# EAGLE design MV16_v1.4 (EAGLE 9.6.2)
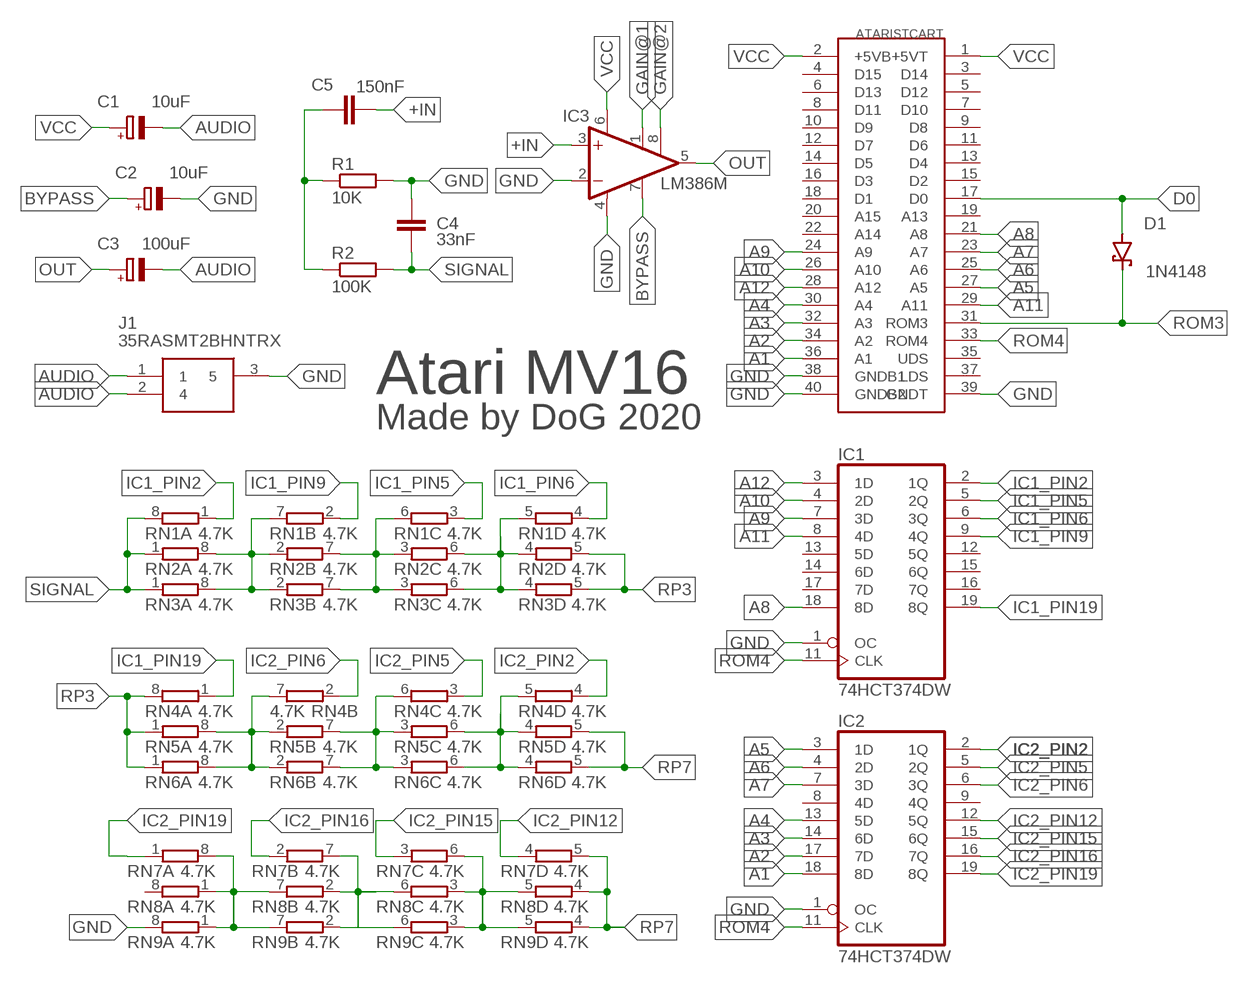
[diagram p0: schematic, sheet 1]

## Parts
C1  10uF  CPOL-EUUD-5X5,8  [UD-5X5,8_NICHICON]
C2  10uF  CPOL-EUUD-5X5,8  [UD-5X5,8_NICHICON]
C3  100uF  CPOL-EUUD-6,3X7,7  [UD-6,3X7,7_NICHICON]
C4  33nF  C-EU  [E/7260-38_NP]
C5  150nF  C-EU  [E/7260-38_NP]
D1  1N4148  BAT60J  [SOD323_ST]
IC1  74HCT374DW  [SO20W]
IC2  74HCT374DW  [SO20W]
IC3  LM386M  LM386M-1  [SO08]
J1  35RASMT2BHNTRX  [35RASMT2BHNTRX_1]
P1  ATARI_ST_CART_FIXED  [ATARI_ST_CART]
R1  10K  R-EU_R0805  [R0805]
R2  100K  R-EU_R0805  [R0805]
RN1  4.7K  4R-NEXBV8V  [EXBV8V]
RN2  4.7K  4R-NEXBV8V  [EXBV8V]
RN3  4.7K  4R-NEXBV8V  [EXBV8V]
RN4  4.7K  4R-NEXBV8V  [EXBV8V]
RN5  4.7K  4R-NEXBV8V  [EXBV8V]
RN6  4.7K  4R-NEXBV8V  [EXBV8V]
RN7  4.7K  4R-NEXBV8V  [EXBV8V]
RN8  4.7K  4R-NEXBV8V  [EXBV8V]
RN9  4.7K  4R-NEXBV8V  [EXBV8V]

## Nets
+IN: C5.- IC3.3(+IN)
A1: IC2.18(8D) P1.36(A1)
A2: IC2.17(7D) P1.34(A2)
A3: IC2.14(6D) P1.32(A3)
A4: IC2.13(5D) P1.30(A4)
A5: IC2.3(1D) P1.27(A5)
A6: IC2.4(2D) P1.25(A6)
A7: IC2.7(3D) P1.23(A7)
A8: IC1.18(8D) P1.21(A8)
A9: IC1.7(3D) P1.24(A9)
A10: IC1.4(2D) P1.26(A10)
A11: IC1.8(4D) P1.29(A11)
A12: IC1.3(1D) P1.28(A12)
AUDIO: C1.- C3.- J1.1 J1.2
BYPASS: C2.+ IC3.7(BYPASS)
D0: D1.A P1.17(D0)
GAIN@1: IC3.1(GAIN)
GAIN@2: IC3.8(GAIN)
GND: C2.- C4.- IC1.1(OC) IC2.1(OC) IC3.2(-IN) IC3.4(GND) J1.3 P1.38(GNDB1) P1.39(GNDT) P1.40(GNDB2) R1.2 RN9.8
IC1_PIN2: IC1.2(1Q) RN1.1
IC1_PIN5: IC1.5(2Q) RN1.3
IC1_PIN6: IC1.6(3Q) RN1.4
IC1_PIN9: IC1.9(4Q) RN1.2
IC1_PIN19: IC1.19(8Q) RN4.1
IC2_PIN2: IC2.2(1Q) RN4.4
IC2_PIN5: IC2.5(2Q) RN4.3
IC2_PIN6: IC2.6(3Q) RN4.2
IC2_PIN12: IC2.12(5Q) RN7.4
IC2_PIN15: IC2.15(6Q) RN7.3
IC2_PIN16: IC2.16(7Q) RN7.2
IC2_PIN19: IC2.19(8Q) RN7.1
N$2: C5.+ R1.1 R2.1
N$3: RN4.7 RN5.2 RN5.8 RN6.2 RN6.8
N$4: RN4.6 RN5.3 RN5.7 RN6.3 RN6.7
N$5: RN4.5 RN5.4 RN5.6 RN6.4 RN6.6
N$8: RN1.7 RN2.2 RN2.8 RN3.2 RN3.8
N$9: RN1.6 RN2.3 RN2.7 RN3.3 RN3.7
N$10: RN1.5 RN2.4 RN2.6 RN3.4 RN3.6
N$20: RN7.8 RN8.1 RN8.7 RN9.1 RN9.7
N$21: RN7.7 RN8.2 RN8.6 RN9.2 RN9.6
N$22: RN7.6 RN8.3 RN8.5 RN9.3 RN9.5
OUT: C3.+ IC3.5(OUT)
ROM3: D1.C P1.31(ROM3)
ROM4: IC1.11(CLK) IC2.11(CLK) P1.33(ROM4)
RP3: RN2.5 RN3.5 RN4.8 RN5.1 RN6.1
RP7: RN5.5 RN6.5 RN7.5 RN8.4 RN9.4
SIGNAL: C4.+ R2.2 RN1.8 RN2.1 RN3.1
VCC: C1.+ IC3.6(VS) P1.1(+5VT) P1.2(+5VB)
Unconnected: IC1.12(5Q) IC1.13(5D) IC1.14(6D) IC1.15(6Q) IC1.16(7Q) IC1.17(7D) IC2.8(4D) IC2.9(4Q) P1.3(D14) P1.4(D15) P1.5(D12) P1.6(D13) P1.7(D10) P1.8(D11) P1.9(D8) P1.10(D9) P1.11(D6) P1.12(D7) P1.13(D4) P1.14(D5) P1.15(D2) P1.16(D3) P1.18(D1) P1.19(A13) P1.20(A15) P1.22(A14) P1.35(UDS) P1.37(LDS) RN8.8

## Notes on the sheet
- Atari MV16
- Made by DoG 2020

## Power pins joined to a net without a drawn wire
GND: IC1.10(GND) IC2.10(GND)
VCC: IC1.20(VCC) IC2.20(VCC)

## Library data of the parts
C1-C3 = rcl:CPOL-EU: POLARIZED CAPACITOR, European symbol; SPICEPREFIX: C
C4 C5 = rcl:C-EU: CAPACITOR, European symbol
D1 = diode:BAT60J: Schottky barrier diode Source: www.st.com, BAT60J.pdf
IC1 IC2 = 74xx-eu:74*374: Octal D type transparent LATCH, edge triggered
IC3 = linear:LM386?-*: Low Voltage Audio Power Amplifier Source: http://cache.national.com/ds/LM/LM386.pdf
J1 = 35RASMT2BHNTRX:35RASMT2BHNTRX: 3.5mm phone jack, surface mount Source: Datasheet <http://www.switchcraft.com/Drawings/35rasmt2bhntrx_cd.pdf>; ALLIED_NUMBER: 70930061; ALLIED_PRICE-STOCK: https://www.alliedelec.com/switchcraft-35rasmt2bhntrx/70930061/; DESCRIPTION: 3.5mm phone jack, surface mount; HEIGHT: mm; MANUFACTURER_NAME: Switchcraft; MANUFACTURER_PART_NUMBER: 35RASMT2BHNTRX; MOUSER_PART_NUMBER: 502-35RASMT2BHNTRX; MOUSER_PRICE-STOCK: https://www.mouser.co.uk/ProductDetail/Switchcraft/35RASMT2BHNTRX?qs=iwvYsH9bSFaJ2uZlz7DW5A%3D%3D
P1 = Atari ST Cart:ATARI_ST_CART_FIXED
R1 R2 = rcl:R-EU_: RESISTOR, European symbol; SPICEPREFIX: R
RN1-RN9 = resistor-dil:4R-N: Array Chip Resistor Source: RS Component / Phycomp; OC_FARNELL: unknown; OC_NEWARK: unknown

## Board
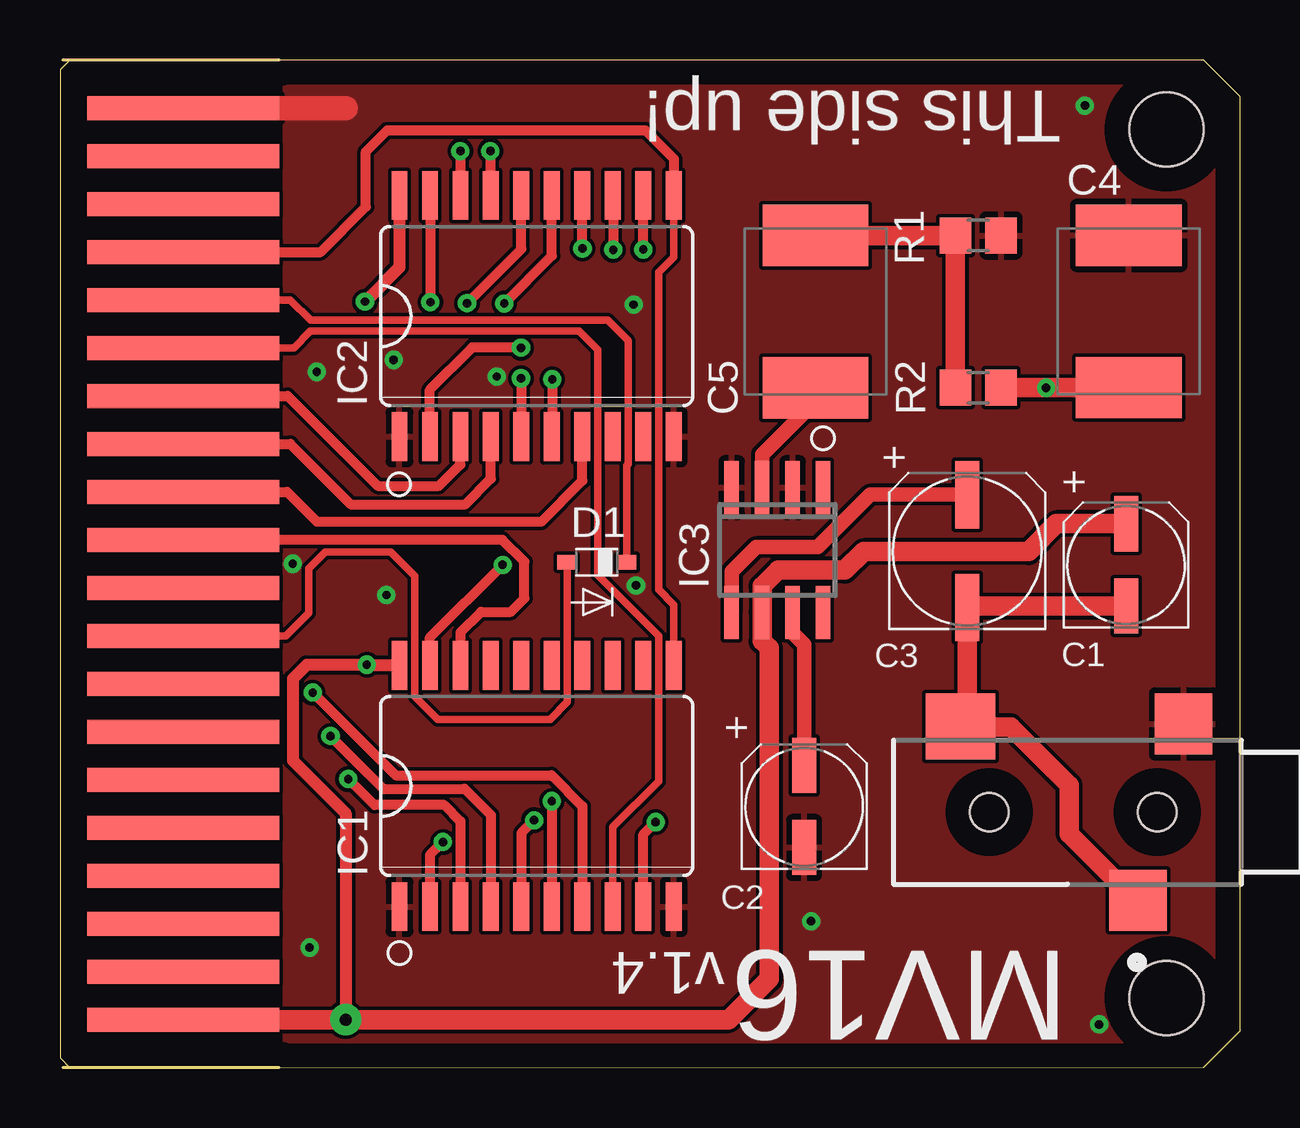
[diagram p1: board, top side]
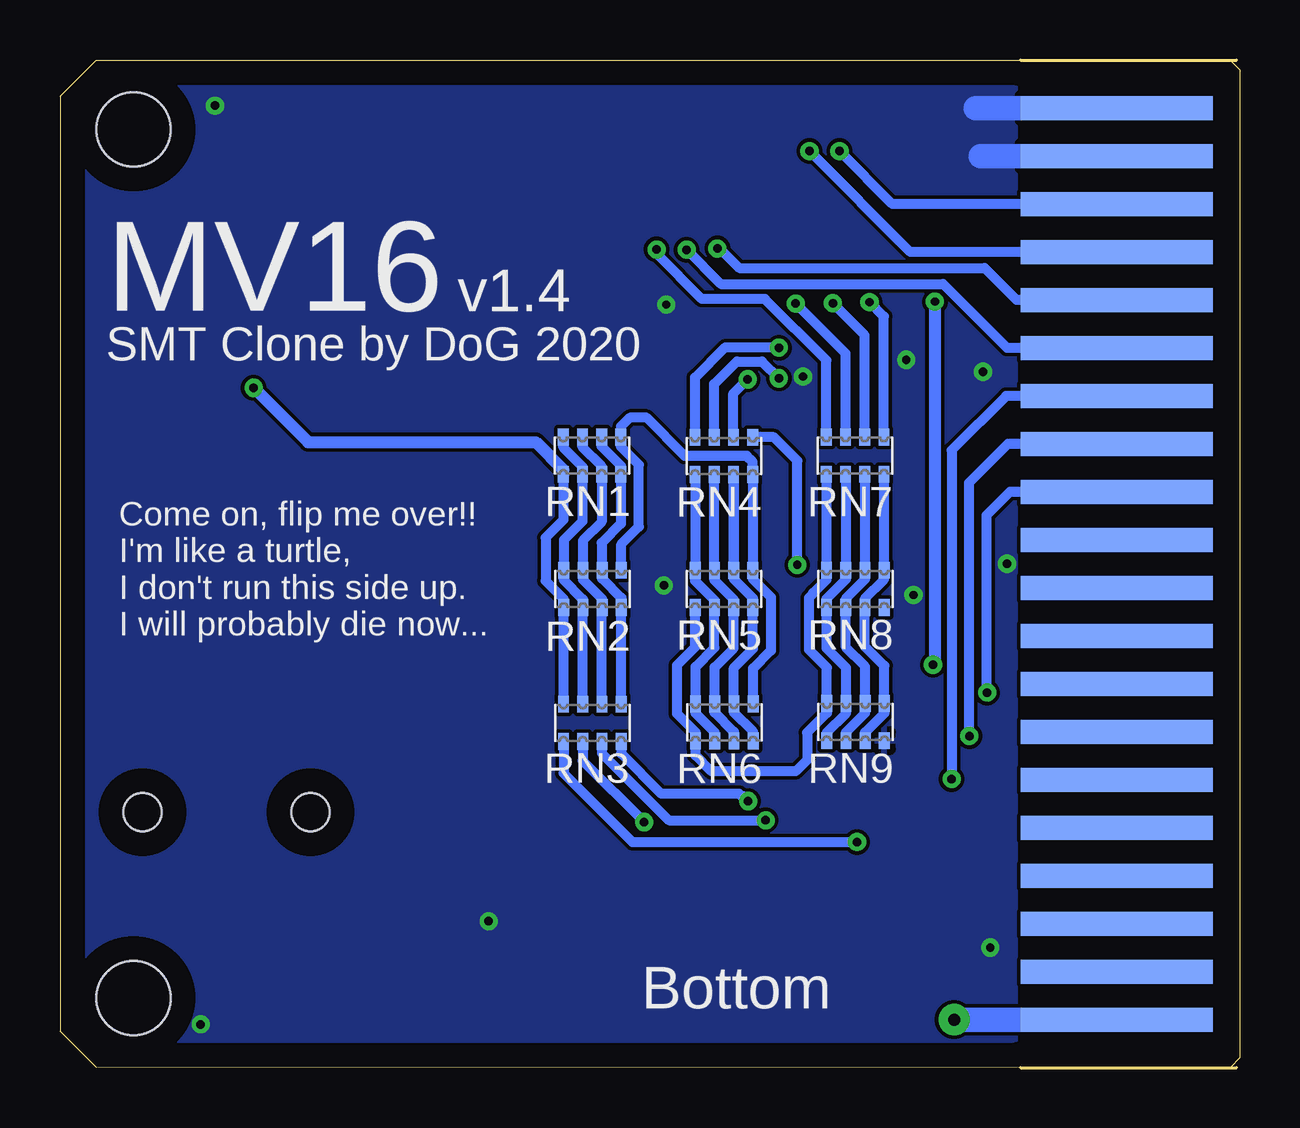
[diagram p2: board, bottom side, seen from below]

Size 49.16 x 42 mm. Coordinates in mm from the lower left corner, seen from the top.
Outline: 49.16,1.52 47.65,0.01 0.4,0 0,0.4 0,41.6 0.4,42 47.65,42 49.16,40.49 49.16,1.52
Outline: 49.16,1.52 49.14,1.5
Copper layers (1*16): Top 0.035mm / dielectric 1.5mm / Bottom 0.035mm
Design rules "default *": minimum track width 6mil, minimum drill 0.35mm, track to track 6mil, track to pad 6mil, pad to pad 6mil, via to via 6mil, smd to smd 6mil, copper to edge 40mil, drill to drill 6mil, minimum pad ring 10mil, minimum via ring 8mil, stop-mask expansion 4mil, vias tented up to drill 50mil, thermal gap 10mil
Holes 3.1 mm at 46.1,39.1 46.1,2.9

### Footprints (pad centres in the part's own frame; a part is rotated, then mirrored left to right if it is on the bottom)
UD-5X5,8_NICHICON = smd 2.3 x 1: + 1.725,0; - -1.7,0
UD-6,3X7,7_NICHICON = smd 2.8 x 1: + 2.35,0; - -2.35,0
E/7260-38_NP = smd 2.55 x 4.4: + 3.175,0; - -3.175,0
SOD323_ST = smd 0.8 x 0.6: A 1.25,0; C -1.25,0
SO20W = smd 0.66 x 2.032: 1 -5.715,-5.029; 2 -4.445,-5.029; 3 -3.175,-5.029; 4 -1.905,-5.029; 5 -0.635,-5.029; 6 0.635,-5.029; 7 1.905,-5.029; 8 3.175,-5.029; 9 4.445,-5.029; 10 5.715,-5.029; 11 5.715,5.029; 12 4.445,5.029; 13 3.175,5.029; 14 1.905,5.029; 15 0.635,5.029; 16 -0.635,5.029; 17 -1.905,5.029; 18 -3.175,5.029; 19 -4.445,5.029; 20 -5.715,5.029
SO08 = smd 0.6 x 2.2: 1 -1.905,-2.6; 2 -0.635,-2.6; 3 0.635,-2.6; 4 1.905,-2.6; 5 1.905,2.6; 6 0.635,2.6; 7 -0.635,2.6; 8 -1.905,2.6
35RASMT2BHNTRX_1 = smd 2.4 x 2.55: 1 4.3,3.675; 3 2.4,-3.675 | smd 2.9 x 2.75: 2 11.7,-3.575 | hole 1.6: 3.5,0; 10.5,0
ATARI_ST_CART = smd 1 x 8: 1 -18,0; 3 -16,0; 5 -14,0; 7 -12,0; 9 -10,0; 11 -8,0; 13 -6,0; 15 -4,0; 17 -2,0; 19 0,0; 21 2,0; 23 4,0; 25 6,0; 27 8,0; 29 10,0; 31 12,0; 33 14,0; 35 16,0; 37 18,0; 39 20,0 | smd 1 x 8 bottom: 2 -18,0; 4 -16,0; 6 -14,0; 8 -12,0; 10 -10,0; 12 -8,0; 14 -6,0; 16 -4,0; 18 -2,0; 20 0,0; 22 2,0; 24 4,0; 26 6,0; 28 8,0; 30 10,0; 32 12,0; 34 14,0; 36 16,0; 38 18,0; 40 20,0
R0805 = smd 1.3 x 1.5: 1 -0.95,0; 2 0.95,0
EXBV8V = smd 0.45 x 0.7: 1 -1.2,-0.775; 2 -0.4,-0.775; 3 0.4,-0.775; 4 1.2,-0.775; 5 1.2,0.775; 6 0.4,0.775; 7 -0.4,0.775; 8 -1.2,0.775

### Placement (x,y rotation side)
C1  44.42,20.95 90 top
C2  31.01,10.87 90 top
C3  37.8,21.53 90 top
C4  44.53,31.52 270 top
C5  31.48,31.51 90 top
D1  22.37,21.06 180 top
IC1  19.86,11.73 0 top
IC2  19.86,31.33 0 top
IC3  29.89,21.57 180 top
J1  49.22,10.64 180 top
P1  5.13,20 90 top
R1  38.26,34.69 0 top
R2  38.26,28.34 0 top
RN1  26.98,14.37 0 bottom
RN2  26.97,19.95 0 bottom
RN3  26.99,25.5 0 bottom
RN4  21.5,25.5 180 bottom
RN5  21.49,19.95 180 bottom
RN6  21.48,14.39 180 bottom
RN7  16.03,25.51 180 bottom
RN8  16.02,19.96 180 bottom
RN9  16.01,14.4 180 bottom

### Tracks (layer width: path | path; a pad name or v marks a point on that pad's centre or on a via)
+IN
  Top 0.61: IC3.3 29.25,25.55 31.32,27.62 31.32,28.34 C5.-
A1  (via drill 0.35)
  Top 0.406: v16.68,38.2 IC2.18
  Bottom 0.406: P1.36 14.48,36 v16.68,38.2
A2  (via drill 0.35)
  Top 0.406: v17.93,38.2 17.93,36.38 IC2.17
  Bottom 0.406: P1.34 13.73,34 v17.93,38.2
A3  (via drill 0.35)
  Top 0.406: v21.77,34.14 IC2.14
  Bottom 0.406: P1.32 9.3,32 10.63,33.33 20.85,33.33 21.66,34.14 v21.77,34.14
A4  (via drill 0.35)
  Top 0.406: v23.05,34.09 23.05,36.34 IC2.13
  Bottom 0.406: P1.30 9.7,30 12.36,32.66 21.62,32.66 v23.05,34.09
A5
  Top 0.406: IC2.3 16.68,25.14 15.79,24.24 13.24,24.24 9.48,28 P1.27
A6
  Top 0.406: P1.25 9.6,26 12.12,23.48 16.89,23.48 17.95,24.55 IC2.4
A7
  Top 0.406: P1.23 9.46,24 10.71,22.75 20.05,22.75 21.77,24.47 IC2.7
A8
  Top 0.406: P1.21 18.43,22 19.34,21.09 19.34,19.56 18.78,18.99 17.55,18.99 16.68,18.13 IC1.18
A9  (via drill 0.35)
  Top 0.406: v10.53,15.63 13.98,12.18 20.48,12.18 21.77,10.9 IC1.7
  Bottom 0.406: P1.24 9.58,24 10.56,23.02 10.56,15.66 v10.53,15.63
A10  (via drill 0.35)
  Top 0.406: v11.27,13.82 13.47,11.62 16.86,11.62 17.95,10.53 IC1.4
  Bottom 0.406: P1.26 9.66,26 11.29,24.37 11.29,13.84 v11.27,13.82
A11
  Top 0.305: P1.29 9.74,30 10.43,30.69 21.63,30.69 22.4,29.92 22.4,20.53 24.94,17.99 24.94,11.94 23.04,10.03 IC1.8
A12  (via drill 0.35)
  Top 0.406: v12.01,12.03 13.1,10.94 16.01,10.94 16.68,10.27 IC1.3
  Bottom 0.406: P1.28 9.74,28 12.01,25.73 v12.01,12.03
AUDIO
  Top 0.813: C1.- 37.87,19.25 C3.- 37.8,14.5 | 37.8,14.5 37.8,14.2 39.61,14.2 42.04,11.77 42.04,9.75 44.82,6.97 J1.1 | 37.8,14.5 J1.2
BYPASS
  Top 0.61: IC3.7 30.52,18.12 31.01,17.63 C2.+
D0
  Top 0.305: D1.A 21.13,15.23 20.42,14.52 15.73,14.52 14.78,15.47 14.78,20.49 13.78,21.49 11.05,21.49 10.36,20.8 10.36,18.95 9.41,18 P1.17
GND  (via drill 0.35)
  Top 0.508: IC1.1 14.14,6.41 14.13,6.43 | IC2.1 14.1,26.35
  Top 0.813: R1.2
  Top 1.016: P1.40 11.9,40
  Bottom 1.016: P1.38 10.8,38 | 10.8,38 | P1.40 11,40 | 11,40
  other vias: 31.3,6.1 13.9,29.5 18.2,28.8 43.3,1.8 42.7,40.1 23.9,31.8 9.7,21 24,20.1 10.7,29 13.6,19.7 10.4,5
  pour Top: 9.3,42 9.3,0 47.7,0 49.2,1.5 49.2,40.6 47.8,42
  pour Bottom: 9.3,42 9.3,0 47.7,0 49.2,1.5 49.2,40.6 47.8,42
IC1_PIN2  (via drill 0.35)
  Top 0.406: v15.95,9.4 15.41,8.86 IC1.2
  Bottom 0.406: RN1.1 28.18,12.27 25.31,9.4 v15.95,9.4
IC1_PIN5  (via drill 0.35)
  Top 0.406: v19.76,10.31 19.23,9.78 IC1.5
  Bottom 0.406: RN1.3 26.58,13.1 23.79,10.31 v19.76,10.31
IC1_PIN6  (via drill 0.35)
  Top 0.406: v20.49,11.1 IC1.6
  Bottom 0.406: RN1.4 25.78,13.09 24.11,11.41 20.87,11.41 20.75,11.3 20.69,11.3 v20.49,11.1
IC1_PIN9  (via drill 0.35)
  Top 0.406: v24.82,10.23 24.3,9.72 IC1.9
  Bottom 0.406: RN1.2 27.38,12.79 v24.82,10.23
IC1_PIN19  (via drill 0.35)
  Top 0.406: IC1.19 15.41,17.93 v18.44,20.95
  Bottom 0.406: v18.44,20.95 18.44,25.3 19.41,26.27 RN4.1
IC2_PIN2  (via drill 0.35)
  Top 0.406: IC2.2 15.41,28.26 17.18,30.02 v19.2,30.02 v19.21,30.01
  Bottom 0.406: RN4.4 22.7,28.77 21.44,30.03 19.23,30.03 v19.21,30.01
IC2_PIN5  (via drill 0.35)
  Top 0.406: v19.21,28.73 19.23,28.73 IC2.5
  Bottom 0.406: v19.21,28.73 19.91,29.43 20.96,29.43 21.9,28.49 RN4.3
IC2_PIN6  (via drill 0.35)
  Top 0.406: v20.51,28.69 20.51,26.31 IC2.6
  Bottom 0.406: RN4.2 21.1,28.1 v20.51,28.69
IC2_PIN12  (via drill 0.35)
  Top 0.406: v24.3,34.1 IC2.12
  Bottom 0.406: RN7.4 17.23,29.48 19.79,32.04 22.42,32.04 24.3,33.92 v24.3,34.1
IC2_PIN15  (via drill 0.35)
  Top 0.406: v18.51,31.85 20.5,33.84 IC2.15
  Bottom 0.406: RN7.3 16.43,29.77 v18.51,31.85
IC2_PIN16  (via drill 0.35)
  Top 0.406: v16.96,31.86 19.23,34.13 IC2.16
  Bottom 0.406: RN7.2 15.63,30.53 v16.96,31.86
IC2_PIN19  (via drill 0.35)
  Top 0.406: IC2.19 15.43,36.34 v15.43,31.91
  Bottom 0.406: RN7.1 14.83,31.31 v15.43,31.91
N$2
  Top 0.508: C5.+ 32.51,34.69
  Top 0.813: 32.51,34.69 R1.1 R2.1
N$3
  Bottom 0.406: RN5.2 21.1,20.73 RN4.7 21.08,24.7 21.08,20.36 20.29,19.57 RN5.8 20.29,17.45 21.08,16.66 RN6.2 21.08,14.8 20.28,14 RN6.8
N$4
  Bottom 0.406: RN4.6 RN5.3 21.89,20.32 21.09,19.52 RN5.7 21.09,17.47 21.88,16.68 RN6.3 21.88,14.8 21.08,14 RN6.7
N$5
  Bottom 0.406: RN4.5 22.7,20.73 | 22.7,20.73 RN5.4 | RN6.6 21.88,13.97 22.68,14.77 RN6.4 22.68,16.7 21.89,17.49 RN5.6 21.89,19.48 22.7,20.29 22.7,20.73
N$8
  Bottom 0.406: RN1.7 RN2.2 27.37,19.52 28.17,20.32 RN2.8 28.17,21.99 27.39,22.77 RN3.2 27.39,25.05 28.19,25.85 RN3.8
N$9
  Bottom 0.406: 26.57,19.54 RN2.3 | 26.57,19.54 27.37,20.34 RN2.7 27.37,21.96 26.59,22.74 RN3.3 26.59,25.07 27.39,25.87 RN3.7 | RN1.6 26.58,19.53 26.57,19.54
N$10
  Bottom 0.406: RN1.5 RN2.4 25.77,19.58 26.57,20.38 RN2.6 26.59,20.75 26.59,21.87 25.79,22.67 RN3.4 25.79,25.09 26.59,25.89 RN3.6
N$20
  Bottom 0.406: RN7.8 RN8.1 14.82,20.35 15.62,19.55 RN8.7 15.62,17.55 14.81,16.74 RN9.1 14.81,14.77 15.61,13.97 RN9.7
N$21
  Bottom 0.406: RN7.7 RN8.2 15.62,20.35 16.42,19.55 RN8.6 16.42,17.52 15.61,16.71 RN9.2 15.61,14.78 16.41,13.98 RN9.6
N$22
  Bottom 0.406: RN7.6 RN8.3 16.42,20.35 17.22,19.55 RN8.5 17.22,17.47 16.41,16.66 RN9.3 16.41,14.77 17.21,13.97 RN9.5
OUT
  Top 0.61: C3.+ 33.75,23.88 31.56,21.69 29,21.69 27.98,20.68 IC3.5
ROM3
  Top 0.305: D1.C 23.62,25.1 23.67,25.16 23.67,30.3 22.82,31.15 19.29,31.15 10.45,31.15 9.6,32 P1.31
ROM4
  Top 0.305: IC2.11 25.57,33.78 24.94,33.15 24.94,19.93 25.57,19.29 IC1.11
  Top 0.406: P1.33 10.86,34 12.74,35.88 12.74,38.18 13.63,39.07 24.39,39.07 25.57,37.89 IC2.11
RP3
  Bottom 0.406: RN2.5 25.77,21.82 25.04,22.55 25.04,25.13 25.79,25.88 RN3.5 25.79,26.72 25.42,27.09 24.72,27.09 23.13,25.5 20.54,25.5 20.3,25.26 RN4.8 20.3,20.73 RN5.1 20.29,20.36 19.54,19.61 19.54,17.38 20.28,16.64 RN6.1
RP7
  Bottom 0.406: RN7.5 RN8.4 17.22,20.34 17.78,19.78 17.78,19.76 17.95,19.59 17.95,17.41 17.21,16.67 RN9.4 17.21,14.78 18.03,13.96 18.03,12.83 18.51,12.35 22.02,12.35 22.68,13.01 RN6.5 22.68,13.97 23.45,14.74 23.45,16.78 22.69,17.54 RN5.5
SIGNAL  (via drill 0.35)
  Top 0.813: R2.2 v41.09,28.34 C4.+
  Bottom 0.406: RN1.8 RN2.1 | RN2.1 | RN3.1 28.19,22.83 28.93,22.09 28.93,20.29 28.18,19.54 RN2.1
  Bottom 0.508: RN3.1 28.19,24.91 29.35,26.07 38.82,26.07 v41.09,28.34
VCC  (via drill 0.35, 0.5 pad 1.3)
  Top 0.508: IC2.20 14.14,33.36 v12.71,31.93 | IC1.20 14.12,16.79 v12.78,16.79 10.28,16.79 9.7,16.21 9.7,12.8 11.9,10.6 v11.9,2
  Top 0.813: P1.2 v11.9,2 27.86,2 29.55,3.7 29.55,17.48 29.25,17.78 IC3.6 29.25,20.07 29.92,20.73 32.7,20.73 33.48,21.51 40.36,21.51 41.52,22.67 C1.+
  Bottom 0.508: v12.71,31.93 12.71,16.86 v12.78,16.79
  Bottom 1.016: P1.2 v11.9,2

### Text on the board
tNames: This side up! | + | + | + | v1.4 | MV16
bNames: v1.4 | MV16 | SMT Clone by DoG 2020 | Come on, flip me over!! / I'm like a turtle, / I don't run this side up. / I will probably die now... | Bottom